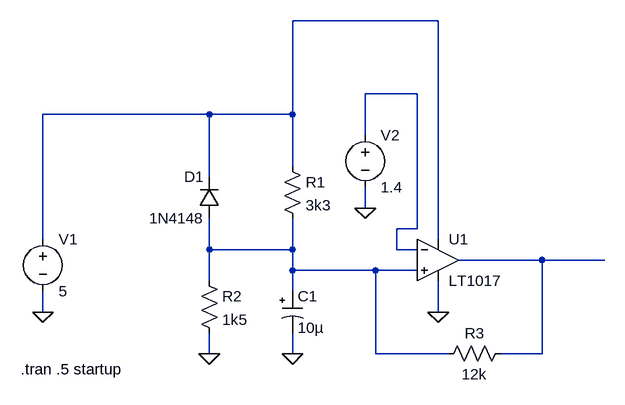
[diagram p0: schematic PowerOnReset.asc]
PowerOnReset.asc, the LTspice schematic file:
Version 4
SHEET 1 880 680
WIRE 320 -176 96 -176
WIRE 288 -64 208 -64
WIRE -32 -32 -288 -32
WIRE 96 -32 96 -176
WIRE 96 -32 -32 -32
WIRE 208 0 208 -64
WIRE 96 48 96 -32
WIRE -32 64 -32 -32
WIRE 208 112 208 80
WIRE 288 144 288 -64
WIRE 288 144 256 144
WIRE -288 160 -288 -32
WIRE 320 160 320 -176
WIRE -32 176 -32 128
WIRE 96 176 96 128
WIRE 96 176 -32 176
WIRE 256 176 256 144
WIRE 288 176 256 176
WIRE 480 192 352 192
WIRE 576 192 480 192
WIRE 96 208 96 176
WIRE 224 208 96 208
WIRE 288 208 224 208
WIRE -32 224 -32 176
WIRE 96 240 96 208
WIRE -288 272 -288 240
WIRE 320 272 320 224
WIRE -32 336 -32 304
WIRE 96 336 96 304
WIRE 224 336 224 208
WIRE 336 336 224 336
WIRE 480 336 480 192
WIRE 480 336 416 336
FLAG -288 272 0
FLAG -32 336 0
FLAG 96 336 0
FLAG 208 112 0
FLAG 320 272 0
SYMBOL res 80 32 R0
SYMATTR InstName R1
SYMATTR Value 3k3
SYMBOL res -48 208 R0
SYMATTR InstName R2
SYMATTR Value 1k5
SYMBOL polcap 80 240 R0
WINDOW 3 24 56 Left 2
SYMATTR InstName C1
SYMATTR Value 10µ
SYMATTR Description Capacitor
SYMATTR Type cap
SYMATTR SpiceLine V=4 Irms=120m Rser=5.1 Lser=0 mfg="Vishay" pn="293D106M004A" type="Tantalum"
SYMBOL diode -16 128 R180
WINDOW 0 24 64 Left 2
WINDOW 3 24 0 Left 2
SYMATTR InstName D1
SYMATTR Value 1N4148
SYMBOL voltage -288 144 R0
WINDOW 123 0 0 Left 0
WINDOW 39 0 0 Left 0
SYMATTR InstName V1
SYMATTR Value 5
SYMBOL voltage 208 -16 R0
WINDOW 123 0 0 Left 0
WINDOW 39 0 0 Left 0
SYMATTR InstName V2
SYMATTR Value 1.4
SYMBOL res 432 320 R90
WINDOW 0 0 56 VBottom 2
WINDOW 3 32 56 VTop 2
SYMATTR InstName R3
SYMATTR Value 12k
SYMBOL Comparators\\LT1017 320 192 R0
SYMATTR InstName U1
TEXT -322 360 Left 2 !.tran .5 startup

The netlist it stands for:
* PowerOnReset.asc
R1 N001 N003 3k3
R2 N003 0 1k5
C1 N003 0 10µ V=4 Irms=120m Rser=5.1 Lser=0 mfg="Vishay" pn="293D106M004A" type="Tantalum"
D1 N003 N001 1N4148
V1 N001 0 5
V2 N002 0 1.4
R3 N004 N003 12k
XU1 N003 N002 N001 0 N004 LT1017  ; pins In+ In- V+ V- OUT
.model D D
.lib standard.dio
.tran .5 startup
.backanno
.end